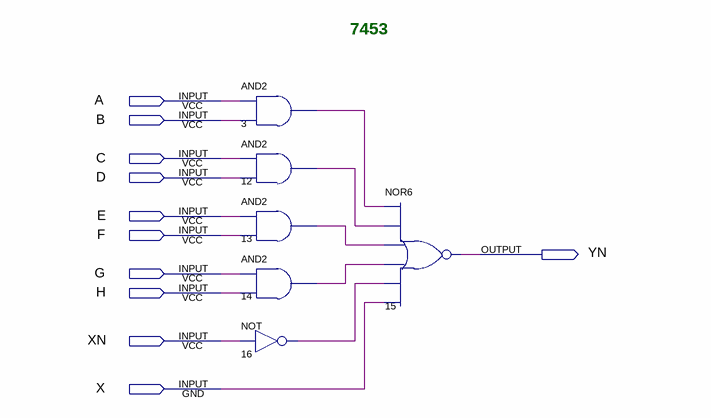
[diagram p0: schematic sheet]
// Quartus schematic 7453.bdf as structural Verilog: 6 symbols, 11 pins
module \7453  (
  input  A,
  input  B,
  input  C,
  input  D,
  input  E,
  input  F,
  input  G,
  input  H,
  input  XN,
  input  X,
  output YN
);

  wire n3_out, n12_out, n13_out, n14_out, n16_out;

  and u_3 (n3_out, A, B);
  and u_12 (n12_out, C, D);
  and u_13 (n13_out, E, F);
  and u_14 (n14_out, G, H);
  not u_16 (n16_out, XN);
  nor u_15 (YN, n3_out, n12_out, n13_out, n14_out, n16_out, X);

  // Notes on the sheet:
  //   7453
endmodule
